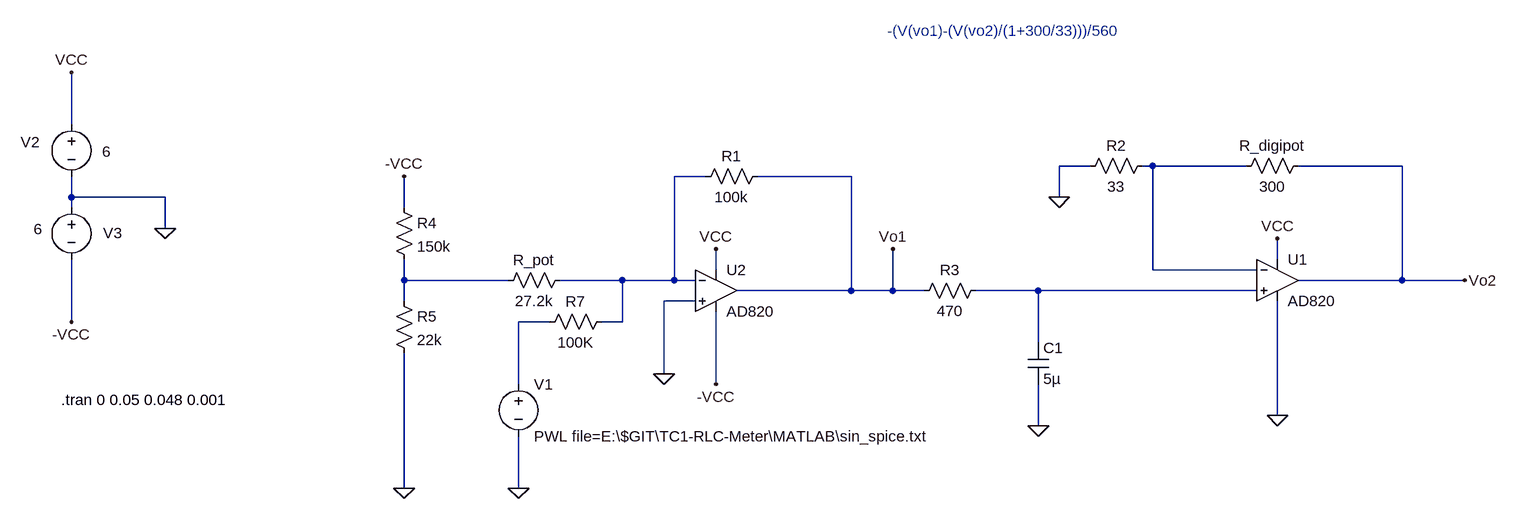
[diagram p0: schematic signal output RailToRail.asc]
signal output RailToRail.asc, the LTspice schematic file:
Version 4
SHEET 1 1692 680
WIRE -512 -128 -512 -208
WIRE 1056 -64 1008 -64
WIRE 1152 -64 1136 -64
WIRE 1296 -64 1152 -64
WIRE 1536 -64 1376 -64
WIRE 464 -48 416 -48
WIRE 688 -48 544 -48
WIRE -512 -16 -512 -48
WIRE -368 -16 -512 -16
WIRE 1008 -16 1008 -64
WIRE -512 0 -512 -16
WIRE 0 0 0 -48
WIRE -368 32 -368 -16
WIRE 1344 80 1344 48
WIRE 480 96 480 64
WIRE 1152 96 1152 -64
WIRE 1312 96 1152 96
WIRE 0 112 0 80
WIRE 160 112 0 112
WIRE 336 112 240 112
WIRE 416 112 416 -48
WIRE 416 112 336 112
WIRE 448 112 416 112
WIRE 1536 112 1536 -64
WIRE 1536 112 1376 112
WIRE 1632 112 1536 112
WIRE 688 128 688 -48
WIRE 688 128 512 128
WIRE 752 128 752 64
WIRE 752 128 688 128
WIRE 800 128 752 128
WIRE 976 128 880 128
WIRE 1312 128 976 128
WIRE 0 144 0 112
WIRE 448 144 400 144
WIRE -512 176 -512 80
WIRE 224 176 176 176
WIRE 336 176 336 112
WIRE 336 176 304 176
WIRE 976 208 976 128
WIRE 400 256 400 144
WIRE 176 272 176 176
WIRE 480 272 480 160
WIRE 1344 320 1344 144
WIRE 976 336 976 272
WIRE 0 432 0 224
WIRE 176 432 176 352
FLAG 176 432 0
FLAG -512 -208 VCC
FLAG -368 32 0
FLAG 480 64 VCC
FLAG 0 432 0
FLAG 0 -48 -VCC
FLAG 1344 48 VCC
FLAG 480 272 -VCC
FLAG -512 176 -VCC
FLAG 400 256 0
FLAG 976 336 0
FLAG 1344 320 0
FLAG 1008 -16 0
FLAG 752 64 Vo1
FLAG 1632 112 Vo2
SYMBOL voltage 176 256 R0
WINDOW 123 0 0 Left 0
WINDOW 39 0 0 Left 0
SYMATTR InstName V1
SYMATTR Value PWL file=E:\$GIT\TC1-RLC-Meter\MATLAB\sin_spice.txt
SYMBOL voltage -512 -144 R0
WINDOW 123 0 0 Left 0
WINDOW 39 0 0 Left 0
WINDOW 0 -78 43 Left 2
WINDOW 3 47 58 Left 2
SYMATTR InstName V2
SYMATTR Value 6
SYMBOL res 560 -64 R90
WINDOW 0 0 56 VBottom 2
WINDOW 3 32 56 VTop 2
SYMATTR InstName R1
SYMATTR Value 100k
SYMBOL OpAmps\\AD820 480 64 R0
SYMATTR InstName U2
SYMBOL res -16 -16 R0
SYMATTR InstName R4
SYMATTR Value 150k
SYMBOL res -16 128 R0
SYMATTR InstName R5
SYMATTR Value 22k
SYMBOL res 256 96 R90
WINDOW 0 0 56 VBottom 2
WINDOW 3 32 56 VTop 2
SYMATTR InstName R_pot
SYMATTR Value 27.2k
SYMBOL res 320 160 R90
WINDOW 0 0 56 VBottom 2
WINDOW 3 32 56 VTop 2
SYMATTR InstName R7
SYMATTR Value 100K
SYMBOL OpAmps\\AD820 1344 48 R0
SYMATTR InstName U1
SYMBOL res 1392 -80 R90
WINDOW 0 0 56 VBottom 2
WINDOW 3 32 56 VTop 2
SYMATTR InstName R_digipot
SYMATTR Value 300
SYMBOL voltage -512 -16 R0
WINDOW 123 0 0 Left 0
WINDOW 39 0 0 Left 0
WINDOW 0 49 55 Left 2
WINDOW 3 -58 49 Left 2
SYMATTR InstName V3
SYMATTR Value 6
SYMBOL res 1152 -80 R90
WINDOW 0 0 56 VBottom 2
WINDOW 3 32 56 VTop 2
SYMATTR InstName R2
SYMATTR Value 33
SYMBOL res 896 112 R90
WINDOW 0 0 56 VBottom 2
WINDOW 3 32 56 VTop 2
SYMATTR InstName R3
SYMATTR Value 470
SYMBOL cap 960 208 R0
SYMATTR InstName C1
SYMATTR Value 5µ
TEXT -528 296 Left 2 !.tran 0 0.05 0.048 0.001
TEXT 744 -272 Left 2 ;-(V(vo1)-(V(vo2)/(1+300/33)))/560

The netlist it stands for:
* signal output RailToRail.asc
V1 N005 0 PWL file=E:\$GIT\TC1-RLC-Meter\MATLAB\sin_spice.txt
V2 VCC 0 6
R1 Vo1 N002 100k
XU2 0 N002 VCC -VCC Vo1 AD820  ; pins In+ In- V+ V- OUT
R4 -VCC N003 150k
R5 N003 0 22k
R_pot N002 N003 27.2k
R7 N002 N005 100K
XU1 N004 N001 VCC 0 Vo2 AD820  ; pins In+ In- V+ V- OUT
R_digipot Vo2 N001 300
V3 0 -VCC 6
R2 N001 0 33
R3 N004 Vo1 470
C1 N004 0 5µ
.tran 0 0.05 0.048 0.001
* -(V(vo1)-(V(vo2)/(1+300/33)))/560
.backanno
.end